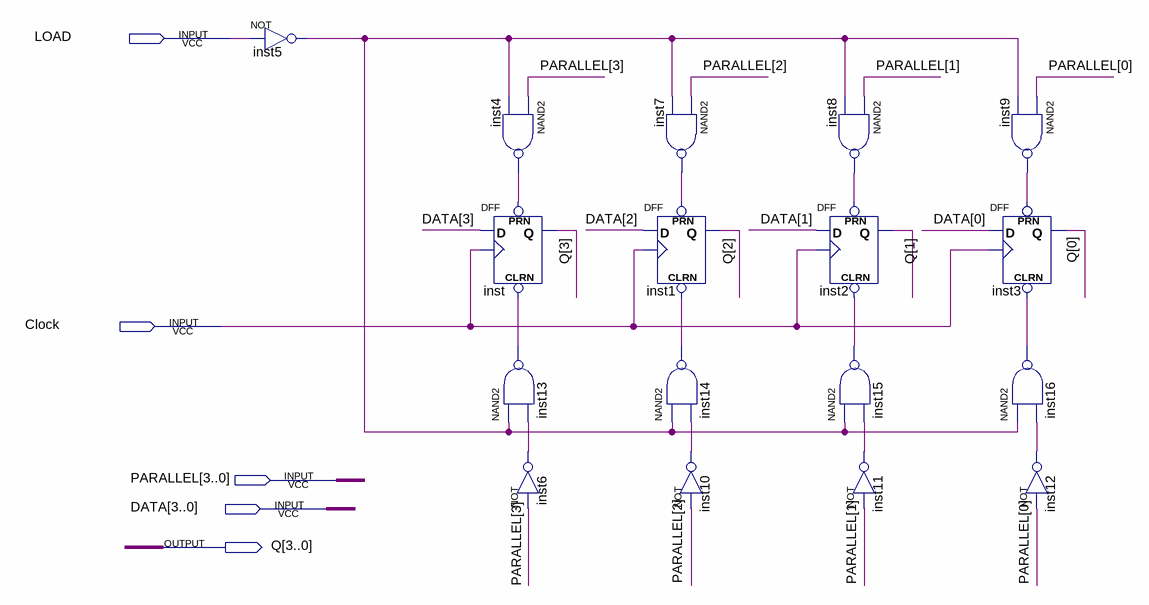
[diagram p0: schematic sheet]
// Quartus schematic Register.bdf as structural Verilog: 17 symbols, 5 pins
module Register (
  input  LOAD,
  input  Clock,
  input  [3:0] PARALLEL,
  input  [3:0] DATA,
  output [3:0] Q
);

  wire inst4_out, inst5_out, inst6_out, inst7_out, inst8_out, inst9_out, inst10_out, inst11_out, inst12_out,
       inst13_out, inst14_out, inst15_out, inst16_out;

  not inst5 (inst5_out, LOAD);
  nand inst4 (inst4_out, PARALLEL[3], inst5_out);
  DFF inst (.CLRN(inst13_out), .CLK(Clock), .D(DATA[3]), .PRN(inst4_out), .Q(Q[3]));
  nand inst13 (inst13_out, inst5_out, inst6_out);
  not inst6 (inst6_out, PARALLEL[3]);
  nand inst7 (inst7_out, PARALLEL[2], inst5_out);
  DFF inst1 (.CLRN(inst14_out), .CLK(Clock), .D(DATA[2]), .PRN(inst7_out), .Q(Q[2]));
  nand inst14 (inst14_out, inst5_out, inst10_out);
  not inst10 (inst10_out, PARALLEL[2]);
  nand inst8 (inst8_out, PARALLEL[1], inst5_out);
  DFF inst2 (.CLRN(inst15_out), .CLK(Clock), .D(DATA[1]), .PRN(inst8_out), .Q(Q[1]));
  nand inst15 (inst15_out, inst5_out, inst11_out);
  not inst11 (inst11_out, PARALLEL[1]);
  DFF inst3 (.CLRN(inst16_out), .CLK(Clock), .D(DATA[0]), .PRN(inst9_out), .Q(Q[0]));
  nand inst9 (inst9_out, PARALLEL[0], inst5_out);
  nand inst16 (inst16_out, inst5_out, inst12_out);
  not inst12 (inst12_out, PARALLEL[0]);
endmodule
